# EasyEDA Pro project 新Exlink多功能调试器.epro, board 信号板
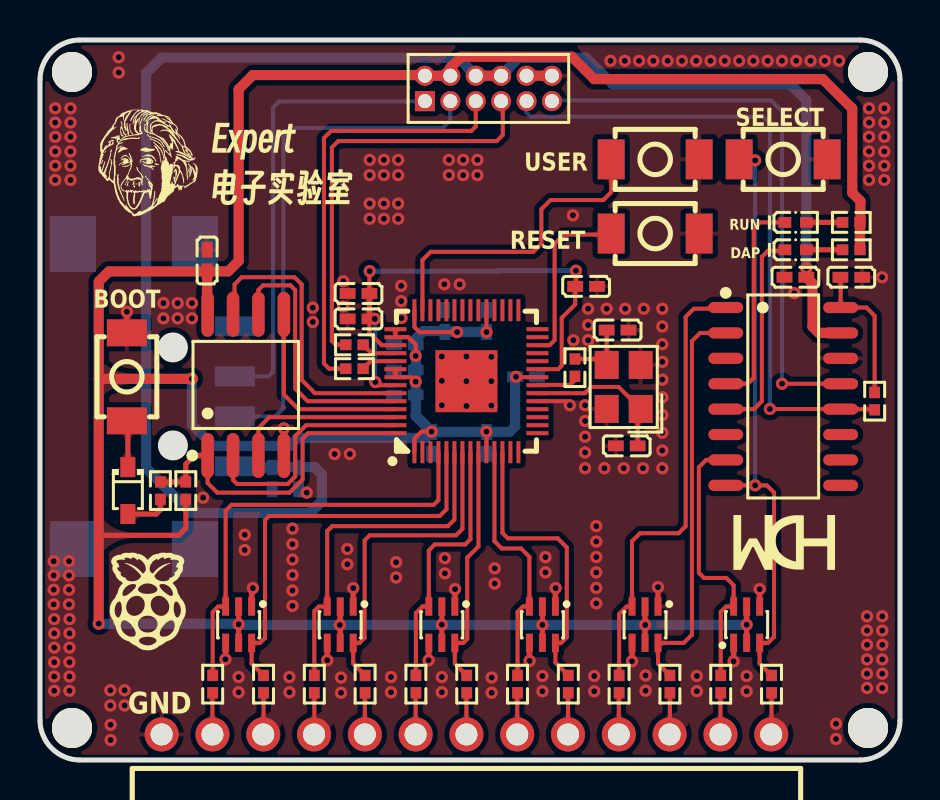
[diagram p4: board, top side]
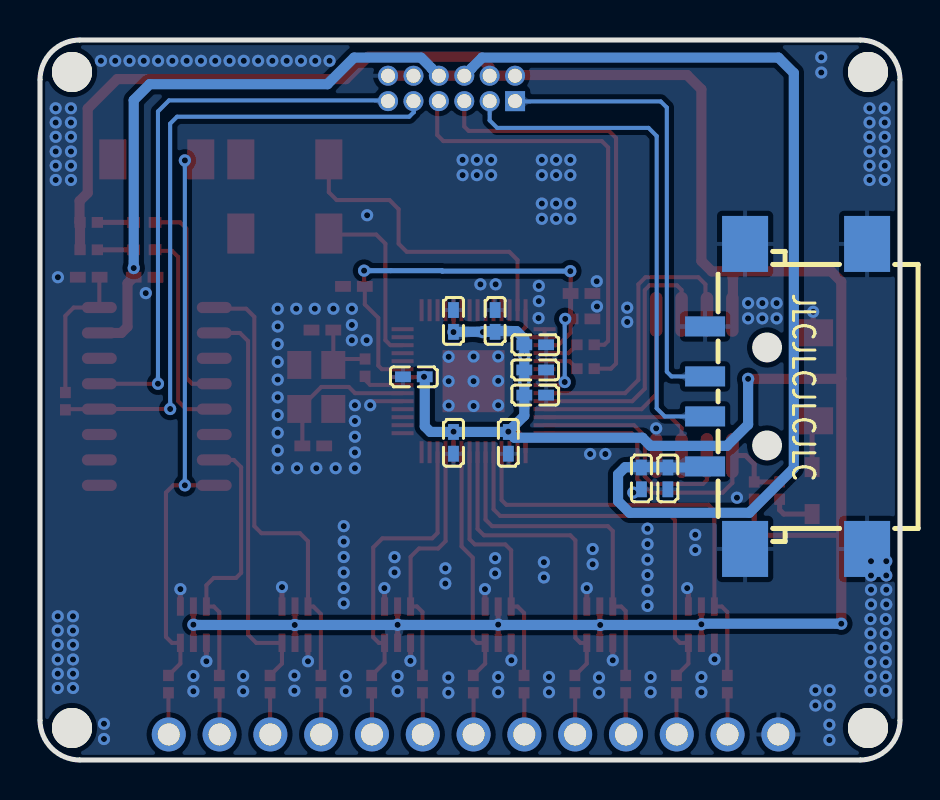
[diagram p5: board, bottom side, seen from below]

Outline 43 x 36 mm; copper layers: Top Layer, Bottom Layer. Coordinates in mm from the lower left corner of the outline.
Outline path: 0,34 0,2 arc(0.59,0.59) 2,0 41,0 arc(42.41,0.59) 43,2 43,34 arc(42.41,35.41) 41,36 2,36 arc(0.59,35.41) 0,34
Stack: Top Layer 0.035mm / Dielectric1 1.51mm FR4 er 4.5 / Bottom Layer 0.035mm

## Design rules (mm)
template: 自定义配置
spacing copperThickness1oz (default): track to track 0.102, other pairs 0.152 to 0.175
spacing copperThickness2oz: track to track 0.203, other pairs 0.152 to 0.3
track width copperThickness1oz (default): min 0.127, default 0.203, max 2.54
track width copperThickness2oz: min 0.203, default 0.254, max 2.54
differential pair differentialPair (default): width min 0.127, default 0.254, max 2.54; gap min 0.152, default 0.152
via viaSize (default): diameter min 0.5, default 0.61, max 10; hole min 0.3, default 0.305, max 6.299

## Placement (name value [footprint] x y rotation side)
C24  9pF  [C0402]  28.88 21.5 180 top
C25  9pF  [C0402]  29.34 15.71 0 top
C26  100nF  [C0402]  8.36 24.97 90 top
C67  100nF  [C0402]  12.93 14.08 270 bottom
C68  10uF  [C0402]  11.61 14.08 270 bottom
C69  100nF  [C0402]  18.24 20.76 180 bottom
C70  100nF  [C0402]  22.33 21.95 270 bottom
C71  100nF  [C0402]  20.24 21.95 270 bottom
C72  100nF  [C0402]  24.31 19.16 180 bottom
C73  100nF  [C0402]  22.33 15.86 90 bottom
C74  100nF  [C0402]  18.24 19.5 0 bottom
C75  100nF  [C0402]  18.24 18.25 0 bottom
C76  100nF  [C0402]  19.58 15.86 90 bottom
C77  100nF  [C0402]  15.93 22.06 0 top
C78  100nF  [C0402]  15.93 23.33 0 top
C79  100nF  [C0402]  27.31 23.68 180 top
C80  100nF  [C0402]  40.57 24.14 0 top
C81  100nF  [C0402]  37.77 24.14 0 top
D29  1N5819WS  [SOD-323_L1.8-W1.3-LS2.5-RD]  4.39 13.47 270 top
D30  BAV99S  [SOT-363_L2.1-W1.3-P0.65-LS2.3-BL]  9.93 6.77 180 top
D31  BAV99S  [SOT-363_L2.1-W1.3-P0.65-LS2.3-BL]  15.01 6.77 180 top
D32  BAV99S  [SOT-363_L2.1-W1.3-P0.65-LS2.3-BL]  20.09 6.77 180 top
D33  BAV99S  [SOT-363_L2.1-W1.3-P0.65-LS2.3-BL]  35.33 6.77 0 top
D34  BAV99S  [SOT-363_L2.1-W1.3-P0.65-LS2.3-BL]  30.25 6.77 180 top
D35  BAV99S  [SOT-363_L2.1-W1.3-P0.65-LS2.3-BL]  25.12 6.77 180 top
H2  DW127R-22-12-23  [HDR-TH_12P-P1.27-V-M-R2-C6-S1.27-1]  22.42 33.58 0 top
H3  KH-2.54PH90-1X13P-L13.8  [HDR-TH_13P-P2.54-H-M-W10.4-N]  21.32 1.28 0 top
LED1  -  [LED_0402]  37.78 26.88 0 top
LED2  -  [LED_0402]  37.78 25.51 0 top
NOREF  -  [Pad_e89]  41.4 1.6 0 top
NOREF#2  -  [Pad_e87]  1.6 34.4 0 top
NOREF#3  -  [Pad_e88]  1.6 1.6 0 top
NOREF#4  -  [Pad_e90]  41.4 34.4 0 top
R3  33Ω  [R0402]  15.72 19.57 180 top
R4  33Ω  [R0402]  15.72 20.76 180 top
R5  10KΩ  [R0402]  7.29 13.47 270 top
R6  1KΩ  [R0402]  6.02 13.47 90 top
R20  1KΩ  [R0402]  26.75 19.62 270 top
R46  33Ω  [R0402]  8.64 3.79 270 top
R47  33Ω  [R0402]  11.18 3.79 270 top
R48  33Ω  [R0402]  13.72 3.79 270 top
R49  33Ω  [R0402]  16.26 3.79 270 top
R50  33Ω  [R0402]  18.8 3.79 270 top
R51  33Ω  [R0402]  21.34 3.79 270 top
R52  33Ω  [R0402]  23.88 3.79 270 top
R53  33Ω  [R0402]  26.42 3.79 270 top
R54  33Ω  [R0402]  28.96 3.79 270 top
R55  33Ω  [R0402]  31.5 3.79 270 top
R56  33Ω  [R0402]  34.04 3.79 270 top
R57  33Ω  [R0402]  36.58 3.79 270 top
R58  2K  [R0402]  40.57 26.88 0 top
R59  2K  [R0402]  40.57 25.51 0 top
R60  4.7K  [R0402]  41.73 17.94 270 top
U15  12MHz  [CRYSTAL-SMD_4P-L3.2-W2.5-BL]  29.18 18.65 90 top
U37  TC-S3403-2.0-260G  [SW-SMD_L4.0-W3.0-LS5.0]  4.34 19.16 270 top
U38  TC-S3403-2.0-260G  [SW-SMD_L4.0-W3.0-LS5.0]  30.76 26.32 0 top
U39  TC-S3403-2.0-260G  [SW-SMD_L4.0-W3.0-LS5.0]  30.76 30.03 0 top
U41  RP2040  [LQFN-56_L7.0-W7.0-P0.4-EP]  21.32 18.94 90 top
U42  W25Q16JVSSIQ  [SOIC-8_L5.3-W5.3-P1.27-LS8.0-BL]  10.29 18.75 0 top
U43  CH549G  [SOP-16_L10.0-W3.9-P1.27-LS6.0-BL]  37.16 18.18 270 top
U44  TC-S3403-2.0-260G  [SW-SMD_L4.0-W3.0-LS5.0]  37.16 30.03 0 top
USB5  USB-A型母座 180度 短体 直边  [USB-A-SMD_WT_C9900004571]  5.69 18.18 90 bottom

## Footprints (pads in the part's own frame, mm; a bottom-side part is the same pattern mirrored in y, then rotated)
C0402
  rect 0.79x0.54 smd: 1(-0.545,0) 2(0.545,0)
CRYSTAL-SMD_4P-L3.2-W2.5-BL
  rect 1.4x1.2 smd: 1(-1.1,-0.85) 2(1.1,-0.85) 3(1.1,0.85) 4(-1.1,0.85)
HDR-TH_12P-P1.27-V-M-R2-C6-S1.27-1
  rect 1x1 hole 0.7: 1(-3.175,-0.635)
  round 1 hole 0.7: 2(-3.175,0.635) 3(-1.905,-0.635) 4(-1.905,0.635) 5(-0.635,-0.635) 6(-0.635,0.635) 7(0.635,-0.635) 8(0.635,0.635) 9(1.905,-0.635) 10(1.905,0.635) 11(3.175,-0.635) 12(3.175,0.635)
HDR-TH_13P-P2.54-H-M-W10.4-N
  round 1.7 hole 1.1: 1(-15.24,0) 2(-12.7,0) 3(-10.16,0) 4(-7.62,0) 5(-5.08,0) 6(-2.54,0) 7(0,0) 8(2.54,0) 9(5.08,0) 10(7.62,0) 11(10.16,0) 12(12.7,0) 13(15.24,0)
LED_0402
  rect 0.637x0.541 smd: 1(-0.538,0) 2(0.538,0)
LQFN-56_L7.0-W7.0-P0.4-EP
  rect 1.1x0.2 smd: 1(-3.55,2.6) 2(-3.55,2.2) 3(-3.55,1.8) 4(-3.55,1.4) 5(-3.55,1) 6(-3.55,0.6) 7(-3.55,0.2) 8(-3.55,-0.2) 9(-3.55,-0.6) 10(-3.55,-1) 11(-3.55,-1.4) 12(-3.55,-1.8) 13(-3.55,-2.2) 14(-3.55,-2.6) 29(3.55,-2.6) 30(3.55,-2.2) 31(3.55,-1.8) 32(3.55,-1.4) 33(3.55,-1) 34(3.55,-0.6) 35(3.55,-0.2) 36(3.55,0.2) 37(3.55,0.6) 38(3.55,1) 39(3.55,1.4) 40(3.55,1.8) 41(3.55,2.2) 42(3.55,2.6)
  rect 0.2x1.1 smd: 15(-2.6,-3.55) 16(-2.2,-3.55) 17(-1.8,-3.55) 18(-1.4,-3.55) 19(-1,-3.55) 20(-0.6,-3.55) 21(-0.2,-3.55) 22(0.2,-3.55) 23(0.6,-3.55) 24(1,-3.55) 25(1.4,-3.55) 26(1.8,-3.55) 27(2.2,-3.55) 28(2.6,-3.55) 43(2.6,3.55) 44(2.2,3.55) 45(1.8,3.55) 46(1.4,3.55) 47(1,3.55) 48(0.6,3.55) 49(0.2,3.55) 50(-0.2,3.55) 51(-0.6,3.55) 52(-1,3.55) 53(-1.4,3.55) 54(-1.8,3.55) 55(-2.2,3.55) 56(-2.6,3.55)
  rect 3.1x3.1 smd: 57(0,0)
Pad_e87
  round 2 hole 2: 58(0,0)
Pad_e88
  round 2 hole 2: 58(0,0)
Pad_e89
  round 2 hole 2: 58(0,0)
Pad_e90
  round 2 hole 2: 58(0,0)
R0402
  rect 0.566x0.54 smd: 1(-0.433,0) 2(0.433,0)
SOD-323_L1.8-W1.3-LS2.5-RD
  rect 1x0.75 smd: 1(-1.173,0) 2(1.173,0)
SOIC-8_L5.3-W5.3-P1.27-LS8.0-BL
  oval 0.63x2.25 smd: 1(-1.905,-3.53) 2(-0.635,-3.53) 3(0.635,-3.53) 4(1.905,-3.53) 5(1.905,3.53) 6(0.635,3.53) 7(-0.635,3.53) 8(-1.905,3.53)
SOP-16_L10.0-W3.9-P1.27-LS6.0-BL
  oval 0.56x1.745 smd: 1(-4.445,-2.873) 2(-3.175,-2.873) 3(-1.905,-2.873) 4(-0.635,-2.873) 5(0.635,-2.873) 6(1.905,-2.873) 7(3.175,-2.873) 8(4.445,-2.873) 9(4.445,2.873) 10(3.175,2.873) 11(1.905,2.873) 12(0.635,2.873) 13(-0.635,2.873) 14(-1.905,2.873) 15(-3.175,2.873) 16(-4.445,2.873)
SOT-363_L2.1-W1.3-P0.65-LS2.3-BL
  rect 0.35x0.916 smd: 1(-0.65,-0.908) 2(0,-0.908) 3(0.65,-0.908) 4(0.65,0.908) 5(0,0.908) 6(-0.65,0.908)
SW-SMD_L4.0-W3.0-LS5.0
  rect 1.35x2 smd: 1(-2.2,0) 2(2.2,0)
USB-A-SMD_WT_C9900004571
  rect 1x2 smd: 1(-3.5,4.05) 2(-1,4.05) 3(1,4.05) 4(3.5,4.05)
  rect 2.8x2.3 smd: 5(-7.625,2.05) 6(-7.625,-4.05) 7(7.625,-4.05) 8(7.625,2.05)

## Nets
As in the schematic.

Pads without a net: NOREF 58; NOREF#2 58; NOREF#3 58; NOREF#4 58; U41 2 3 13 14 15 16 17 18 24 25 27 28 29 30 31 32 34 35 36 37 38 39 40; U43 3 6 9 10 11

## Via types
v1: diameter 0.61, hole 0.305, Top Layer to Bottom Layer, 242 vias

## Routing (per net, layer and track width the routed paths; a pad name or vN(x,y) marks a point on that pad's centre or on a via; arc(x,y) is an arc through that point)
3V3: length 171.6
  Top Layer w0.203: U41.1 18.72,16.06 19.07,16.42 v1(19.58,16.42) ; U41.43 U41.44 18.42,21.14 18.78,20.77 v1(18.78,20.2) ; U41.48 U41.49 18.56,19.14 v1(18.78,18.92) ; v1(20.85,21.39) 18.97,21.39 18.72,21.65 U41.42 ; U41.33 22.32,21.4 v1(22.33,21.39) ; v1(23.8,19.16) 23.82,19.14 U41.22 ; U41.10 v1(22.32,16.42)
  Top Layer w0.254: D31.2 15.01,5.86 ; 25.12,5.86 v1(25.12,6.76) D35.2 ; R5.2 7.29,11.59 6.93,11.23 3.02,11.23 2.94,11.16 ; D30.2 v1(9.93,6.79) 9.93,5.86 ; 20.09,5.86 v1(20.09,6.77) D32.2 ; D33.5 35.33,5.86 ; D34.2 30.25,5.86
  Top Layer w0.508: 2.95,19.06 2.94,19.04 v1(2.94,6.82) ; 2.95,19.06 v1(7.59,19.06) ; 2.95,19.06 2.94,19.08 2.94,23.92 3.44,24.43 C26.1 ; C26.1 9.41,24.43 9.93,24.95 9.93,33.54 10.64,34.25 19.21,34.25 H2.2 H2.4 20.52,34.62 21.06,35.16 26.59,35.16 27.71,34.04 39.14,34.04 40.61,32.57 40.61,28.36 41.02,27.95 41.02,26.9 R58.2 R59.2 ; C26.1 8.36,22.31 U42.8
  Bottom Layer w0.203: v1(19.58,16.42) 19.58,16.4 ; 22.33,16.4 22.32,16.41 v1(22.32,16.42) ; v1(22.33,21.39) C70.2
  Bottom Layer w0.508: 19.58,16.4 23.48,16.4 23.76,16.68 C72.2 ; v1(35.33,6.77) 35.32,6.75 v1(30.26,6.75) v1(14.99,6.75) 9.97,6.75 v1(9.93,6.79) 9.9,6.82 v1(2.94,6.82) ; 20.24,21.45 19.18,21.45 18.78,21.05 C69.1 v1(18.78,20.2) C74.2 v1(18.78,18.92) C75.2 18.78,17.22 v1(19.58,16.42) 19.28,16.11 12.88,16.11 12.47,15.71 8.66,15.71 7.59,16.77 v1(7.59,19.06) ; 20.24,21.45 20.57,21.45 20.61,21.41 ; 20.24,21.45 20.61,21.41 ; 20.61,21.41 C70.2
+1V: length 25.8
  Top Layer w0.203: U41.45 17.09,20.74 16.47,21.36 C77.2 v1(16.74,22.06) ; v1(26.8,24.47) 26.8,23.72 C79.2 26.76,22.78 26.09,22.11 26.09,19.72 25.91,19.54 U41.23 ; U41.50 16.92,18.74 v1(16.77,18.9) ; C78.2 16.47,24.23 16.48,24.24 v1(16.48,24.44)
  Top Layer w0.254: C78.2 C77.2
  Bottom Layer w0.203: v1(16.77,18.9) 16.77,22.03 v1(16.74,22.06)
  Bottom Layer w0.254: v1(16.48,24.44) 22.88,24.44 22.91,24.47 25.46,24.47 ; 25.46,24.47 v1(26.8,24.47)
+5V: length 83.5
  Top Layer w0.508: U43.15 38.93,21.35 38.62,21.66 38.62,23.83 C81.2 v1(38.31,24.6) ; H2.6 23.06,34.21
  Bottom Layer w0.508: 23.06,34.21 23.42,34.58 23.42,34.59 23.95,35.12 27.3,35.12 28.63,33.79 37.52,33.79 38.31,32.99 v1(38.31,24.6) ; USB5.1 9.8,14.62 C68.1 11.62,14.64 13.74,14.64 14.1,14.28 14.1,12.94 13.51,12.36 7.54,12.36 5.31,14.59 5.31,34.35 6.08,35.12 20.89,35.12 21.42,34.59 21.42,34.58 H2.6
GND: length 16.2
  Top Layer w0.203: v1(26.49,17.74) 26.29,17.94 U41.19
  Top Layer w0.254: 14.36,5.86 v1(14.36,4.99) ; v1(9.27,5.04) 9.28,5.05 9.28,5.86 ; 34.68,5.86 v1(34.68,4.94) ; v1(19.43,4.99) 19.44,5 19.44,5.86 ; v1(24.48,4.96) 24.47,4.97 24.47,5.86 ; v1(25.78,8.59) 25.77,8.58 D35.1 ; D32.1 20.75,7.68 v1(20.75,8.54) ; D34.1 v1(30.9,8.64) ; U37.1 v1(4.34,22.41) ; 29.6,5.86 v1(29.6,4.94) ; D33.4 v1(35.98,8.54) ; D31.1 v1(15.66,8.59) ; D30.1 10.58,8.53 v1(10.64,8.59) ; U42.4 v1(12.19,16.58)
  Top Layer w0.508: H2.10 H2.12
  vias: v1(0.76,32.58) v1(0.76,31.87) v1(0.76,31.16) v1(0.76,30.43) v1(0.76,29.71) v1(0.76,29) v1(0.69,9.94) v1(0.69,9.23) v1(0.69,8.51) v1(0.69,7.78) v1(0.71,7.05) v1(0.71,6.33) v1(0.71,5.62) v1(0.71,4.89) v1(0.71,4.17) v1(0.71,3.46) v1(1.45,9.94) v1(1.45,9.23) v1(1.45,8.51) v1(1.45,7.78) v1(1.53,32.58) v1(1.53,31.87) v1(1.53,31.16) v1(1.52,30.43) v1(1.52,29.71) v1(1.52,29) v1(1.47,7.05) v1(1.47,6.33) v1(1.47,5.62) v1(1.47,4.89) v1(1.47,4.17) v1(1.47,3.46) v1(3.52,3.49) v1(3.52,2.73) v1(3.53,1.76) v1(3.53,1) v1(3.94,35.14) v1(3.94,34.37) v1(4.23,3.49) v1(4.23,2.73) v1(6.17,22.84) v1(6.17,22.08) v1(6.88,22.84) v1(6.88,22.08) v1(7.6,22.84) v1(7.6,22.08) v1(8.15,13.11) v1(9.93,4.15) v1(9.93,3.39) v1(10.24,11.26) v1(10.24,10.5) v1(12.47,4.15) v1(12.47,3.39) v1(12.62,11.57) v1(12.62,10.79) v1(12.62,10.02) v1(12.62,9.25) v1(12.62,8.48) v1(12.62,7.7) v1(13.33,13.37) v1(13.64,22.61) v1(13.64,21.9) v1(14.73,15.3) v1(15.05,4.12) v1(15.05,3.36) v1(15.16,23.94) v1(15.15,22.67) v1(15.37,10.55) v1(15.37,9.79) v1(15.49,15.3) v1(16.48,30.01) v1(16.48,29.24) v1(16.48,27.82) v1(16.48,27.06) v1(17.2,30.01) v1(17.2,29.24) v1(17.2,27.82) v1(17.2,27.06) v1(17.55,4.15) v1(17.55,3.39) v1(17.81,9.89) v1(17.81,9.13) v1(17.91,30.01) v1(17.91,29.24) v1(17.91,27.82) v1(17.91,27.06) v1(18.06,23.71) v1(18.06,22.94) v1(18.07,22.1) v1(20.09,20.17) v1(20.09,18.96) v1(20.09,17.74) v1(20.09,4.15) v1(20.09,3.39) v1(20.22,23.78) v1(20.24,10.09) v1(20.24,9.33) v1(20.44,30.01) v1(20.44,29.24) v1(20.98,23.78) v1(21.16,30.01) v1(21.16,29.24) v1(21.32,20.17) v1(21.32,18.94) v1(21.32,17.7) v1(21.87,30.01) v1(21.87,29.24) v1(22.57,20.16) v1(22.57,18.94) v1(22.57,17.72) v1(22.58,4.12) v1(22.58,3.36) v1(22.73,9.58) v1(22.73,8.82) v1(25.12,4.2) v1(25.12,3.44) v1(25.27,10.14) v1(25.27,9.38) v1(26.64,27.24) v1(26.67,20.99) v1(27.25,17.74) v1(27.25,16.95) v1(27.25,16.16) v1(27.25,15.38) v1(27.25,14.59) v1(27.41,22.56) v1(27.41,21.75) v1(27.41,20.99) v1(27.71,4.2) v1(27.71,3.44) v1(27.81,11.69) v1(27.81,10.92) v1(27.81,10.15) v1(27.81,9.38) v1(27.81,8.6) v1(27.81,7.83) v1(28.22,14.59) v1(28.33,22.56) v1(28.52,34.96) v1(29.24,34.96) v1(29.26,22.56) v1(29.18,14.59) v1(29.95,34.96) v1(30.15,14.59) v1(30.19,22.56) v1(30.28,4.23) v1(30.28,3.46) v1(30.67,34.96) v1(31.12,22.56) v1(31.12,21.68) v1(31.12,20.79) v1(31.12,19.91) v1(31.12,19.02) v1(31.12,18.13) v1(31.12,17.25) v1(31.12,16.36) v1(31.12,15.47) v1(31.12,14.59) v1(31.38,34.96) v1(32.1,34.96) v1(32.81,34.96) v1(32.84,4.2) v1(32.84,3.44) v1(33.52,34.96) v1(34.24,34.96) v1(34.95,34.96) v1(35.33,4.2) v1(35.33,3.44) v1(35.67,34.96) v1(36.38,34.96) v1(37.1,34.96) v1(37.71,23.34) v1(37.81,34.96) v1(38.53,34.96) v1(39.24,34.96) v1(39.8,1.81) v1(39.8,1.05) v1(39.95,34.96) v1(41.35,7.19) v1(41.35,6.47) v1(41.35,5.76) v1(41.35,5.03) v1(41.35,4.31) v1(41.35,3.6) v1(41.45,32.58) v1(41.45,31.87) v1(41.45,31.16) v1(41.45,30.43) v1(41.45,29.71) v1(41.45,29) v1(42.1,24.14) v1(42.11,7.19) v1(42.11,6.47) v1(42.11,5.76) v1(42.11,5.03) v1(42.11,4.31) v1(42.11,3.6) v1(42.22,32.58) v1(42.22,31.87) v1(42.22,31.16) v1(42.21,30.43) v1(42.21,29.71) v1(42.21,29)
ADC3: length 16
  Top Layer w0.203: 28.56,30.03 28.56,28.39 28.17,28 25.53,28 25.07,27.54 25.07,25.81 24.66,25.41 19.53,25.41 19.12,25 U41.41
CH549_DN: length 28.3
  Top Layer w0.203: U43.13 v1(37.1,18.81)
  Bottom Layer w0.203: H2.11 25.63,32.98 36.55,32.98 37.1,32.43 v1(37.1,18.81)
CH549_DP: length 32.5
  Top Layer w0.203: v1(36.49,17.55) 40.03,17.55 U43.12 41.7,17.54 R60.2
  Bottom Layer w0.203: H2.9 24.31,32.92 24.31,32.39 24.54,32.16 36.14,32.16 36.49,31.82 v1(36.49,17.55)
CHAN0: length 22
  Top Layer w0.203: U41.4 19.92,13 19.69,12.76 9.58,12.76 9.28,12.47 D30.3 8.91,7.67 8.64,7.4 R46.1
CHAN1: length 20.7
  Top Layer w0.203: R47.1 10.58,4.82 10.58,5.86 11,5.86 11.25,6.1 11.25,12 11.46,12.2 19.99,12.2 20.32,12.53 U41.5
CHAN2: length 17.7
  Top Layer w0.203: R48.1 13.72,7.45 13.94,7.67 D31.3 14.36,11.45 14.6,11.69 20.4,11.69 20.72,12.02 U41.6
CHAN3: length 16.4
  Top Layer w0.203: R49.1 15.66,4.82 15.66,5.86 15.98,5.86 16.23,6.1 16.23,10.98 16.48,11.23 20.8,11.23 21.12,11.55 U41.7
CHAN4: length 13.4
  Top Layer w0.203: U41.8 21.52,11.04 21.26,10.78 19.74,10.78 19.44,10.48 D32.3 19.12,7.67 18.8,7.35 R50.1
CHAN5: length 12.1
  Top Layer w0.203: U41.9 21.92,10.68 21.36,10.12 21.36,6.05 21.16,5.86 20.74,5.86 20.74,4.82 R51.1
CHAN6: length 12.9
  Top Layer w0.203: U41.11 22.72,10.94 23.09,10.58 24.05,10.58 24.47,10.16 D35.3 24.46,7.68 24.16,7.68 23.88,7.4 R52.1
CHAN7: length 14.6
  Top Layer w0.203: U41.12 23.12,11.35 23.39,11.08 25.88,11.08 26.34,10.63 26.34,6.14 26.06,5.86 25.77,5.86 25.77,4.87 R53.1
D0: length 9.9
  Top Layer w0.203: U41.53 12.92,17.54 12.19,18.27 U42.5
D1: length 11.8
  Top Layer w0.203: U42.2 9.65,14 9.85,13.8 12.38,13.8 12.76,14.18 12.76,16.2 13.3,16.74 U41.55
D2: length 8.4
  Top Layer w0.203: U41.54 11.47,17.14 10.92,16.59 U42.3
D3: length 14.9
  Top Layer w0.203: U41.51 13.75,18.34 13.08,19.01 13.08,23.78 12.72,24.14 10.08,24.14 9.73,23.78 9.73,22.36 U42.7
LED_CON: length 10.5
  Top Layer w0.203: LED2.1 37.19,25.46 36.4,25.46 36.09,25.15 36.09,17.94 35.7,17.54 U43.5
LED_RUN: length 10.7
  Top Layer w0.203: LED1.1 35.99,26.88 35.69,26.58 35.69,19.11 35.39,18.81 U43.4
PICO_DN: length 21
  Top Layer w0.203: R4.2 14.78,20.76 14.59,20.95 14.59,30.63 14.91,30.95 22.83,30.95 23.14,31.25 23.14,32.86 23.06,32.94
PICO_DP: length 21.6
  Top Layer w0.203: R3.2 14.45,19.57 14.2,19.82 14.2,31.1 14.55,31.45 21.56,31.45 21.79,31.68 H2.5
RUN: length 8.8
  Top Layer w0.203: U41.26 25.48,20.74 25.73,20.99 25.73,25.81 26.19,26.27 28.51,26.27 28.56,26.32
RXD: length 13.8
  Top Layer w0.203: U43.7 33.31,15 32.94,14.64 32.94,9.36 33.2,9.1 34.31,9.1 34.68,8.74 34.68,7.67 34.31,7.67 34.04,7.4 R56.1
SCK: length 20.3
  Top Layer w0.203: U43.2 33,21.35 32.6,20.95 32.6,6.27 32.19,5.86 30.9,5.86 30.9,4.82 R55.1
SCLK: length 13.5
  Top Layer w0.203: U42.6 10.92,23.5 11.15,23.73 12.52,23.73 12.76,23.49 12.76,18.57 13.39,17.94 U41.52
SS: length 16.8
  Top Layer w0.203: U42.1 8.38,13.85 8.86,13.37 12.47,13.37 13.13,14.03 13.13,16.06 13.41,16.34 U41.56
  Top Layer w0.254: 6.02,13.9 7.29,13.9 7.29,14.79 7.72,15.22 U42.1
SWD: length 22.8
  Top Layer w0.203: R54.1 28.96,7.3 29.33,7.67 D34.3 29.6,10.94 30,11.34 31.93,11.34 32.28,11.69 32.28,22.16 32.69,22.56 34.23,22.56 U43.1
TXD: length 29.6
  Top Layer w0.203: U44.1 35.01,29.98 v1(35.76,29.98) ; R57.1 35.98,4.82 35.98,5.86 36.4,5.86 36.7,6.16 36.7,13.37 36.34,13.73 v1(35.76,13.73) U43.8
  Bottom Layer w0.203: v1(35.76,13.73) v1(35.76,29.98)
USBA_DN: length 25.8
  Bottom Layer w0.203: USB5.2 11.76,17.18 12.17,17.58 12.17,31.2 12.57,31.61 20.14,31.61 20.52,31.98 H2.3
USBA_DP: length 22.9
  Bottom Layer w0.203: H2.1 19.23,32.93 11.96,32.93 11.66,32.62 11.66,19.41 11.42,19.18 USB5.3
XI: length 7.7
  Top Layer w0.203: U41.20 27.25,18.34 27.56,18.65 28.93,18.65 U15.1 29.88,17.4 C25.2
XO: length 2.2
  Top Layer w0.203: R20.2 26.75,19.01 26.49,18.75 24.89,18.75 U41.21
$1N3717: length 3.5
  Top Layer w0.203: R20.1 28.04,20.05 U15.3 28.33,21.5
$1N3739: length 2.2
  Top Layer w0.254: R6.1 6.02,12.5 5.81,12.3 D29.2
$1N4612: length 2.3
  Top Layer w0.254: U37.2 4.39,16.91 D29.1
$1N6399: length 1.8
  Top Layer w0.203: U41.47 16.53,19.94 16.16,19.57
$1N6401: length 1.8
  Top Layer w0.203: U41.46 16.58,20.34 16.16,20.76
$1N7068: length 2.1
  Top Layer w0.203: H3.2 8.62,3.35 R46.2
$1N7111: length 2.1
  Top Layer w0.203: R47.2 11.18,1.29 H3.3
$1N7154: length 2.1
  Top Layer w0.203: H3.4 13.72,1.29 R48.2
$1N7197: length 2.1
  Top Layer w0.203: R49.2 16.24,3.35 H3.5
$1N7240: length 2.1
  Top Layer w0.203: R50.2 18.78,3.35 H3.6
$1N7283: length 2.1
  Top Layer w0.203: R51.2 21.32,3.35 H3.7
$1N7326: length 2.1
  Top Layer w0.203: H3.8 23.86,3.35 R52.2
$1N7369: length 2.1
  Top Layer w0.203: R53.2 26.4,3.35 H3.9
$1N7412: length 2.1
  Top Layer w0.203: R54.2 28.94,3.35 H3.10
$1N7455: length 2.1
  Top Layer w0.203: R55.2 31.5,1.29 H3.11
$1N7498: length 2.1
  Top Layer w0.203: R56.2 34.02,3.35 H3.12
$1N7541: length 2.1
  Top Layer w0.203: R57.2 36.58,1.29 H3.13
$1N10559: length 7.2
  Top Layer w0.203: C80.1 40.03,24.13 U43.16 41.32,22.62 41.73,22.21 R60.1
$1N10835: length 1.8
  Top Layer w0.254: LED1.2 40.13,26.88
$1N10837: length 1.8
  Top Layer w0.254: LED2.2 R59.1

## Copper pours and planes (outline as drawn; the poured copper is in the pictures)
GND on Top Layer: -1.85,38.11 45.39,38.11 45.39,-2.28 -1.85,-2.28
GND on Bottom Layer: -2.62,39.02 46.51,39.02 46.51,-3.4 -2.62,-3.4

Small or netless copper shapes (teardrops, artwork), in the pictures only: 185 on Top Layer, 46 on Bottom Layer

## Text on the board
Bottom Silkscreen Layer: JLCJLCJLCJLC
Top Silkscreen Layer: RUN | DAP | BOOT | RESET | USER | SELECT | GND
